# Altium schematic sheet Amplifiers2.SchDoc
size A4; SheetNumber: 6; SheetTotal: 7
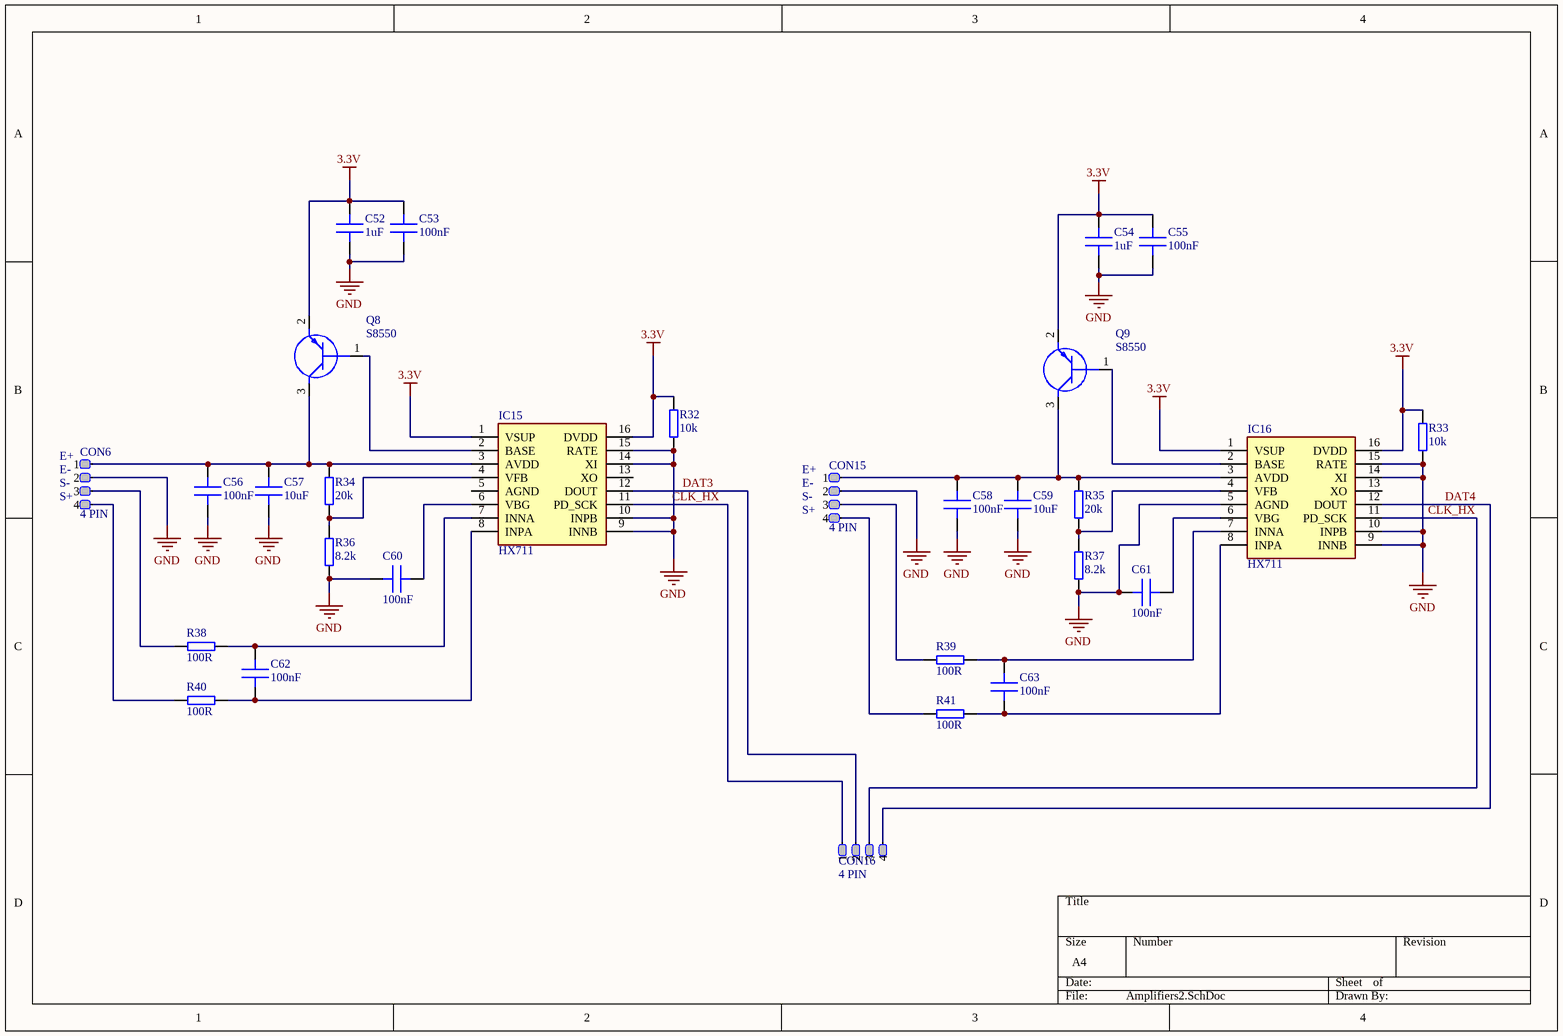
[diagram p0: Amplifiers2.SchDoc]

## Parts
C52  1uF  [C 0402]
C53  100nF  [C 0402]
C54  1uF  [C 0402]
C55  100nF  [C 0402]
C56  100nF  [C 0402]
C57  10uF  [C 0402]
C58  100nF  [C 0402]
C59  10uF  [C 0402]
C60  100nF  [C 0402]
C61  100nF  [C 0402]
C62  100nF  [C 0402]
C63  100nF  [C 0402]
CON6  4 PIN  [BM04B-SRSS-TB]
CON15  4 PIN  [BM04B-SRSS-TB]
CON16  4 PIN  [Goldpin 1.27mm 4PIN]
IC15  HX711  [SOIC127P600X160-16N]
IC16  HX711  [SOIC127P600X160-16N]
Q8  S8550  [SOT95P240X110-3N]
Q9  S8550  [SOT95P240X110-3N]
R32  10k  [R 0402]
R33  10k  [R 0402]
R34  20k  [R 0402]
R35  20k  [R 0402]
R36  8.2k  [R 0402]
R37  8.2k  [R 0402]
R38  100R  [R 0402]
R39  100R  [R 0402]
R40  100R  [R 0402]
R41  100R  [R 0402]

## Nets
3.3V: C52.1 C53.1 C54.1 C55.1 IC15.1(VSUP) IC15.16(DVDD) IC16.1(VSUP) IC16.16(DVDD) Q8.2(E) Q9.2(E) R32.2 R33.2
GND: C52.2 C53.2 C54.2 C55.2 C56.2 C57.2 C58.2 C59.2 C60.1 C61.1 CON6.2 CON15.2 IC15.9(INNB) IC15.10(INPB) IC15.14(XI) IC15.15(RATE) IC16.5(AGND) IC16.9(INNB) IC16.10(INPB) IC16.14(XI) IC16.15(RATE) R32.1 R33.1 R36.1 R37.1
CLK_HX: CON16.1 CON16.3 IC15.11(PD_SCK) IC16.11(PD_SCK)
DAT3: CON16.2 IC15.12(DOUT)
DAT4: CON16.4 IC16.12(DOUT)
NetC56_1: C56.1 C57.1 CON6.1 IC15.3(AVDD) Q8.3(C) R34.2
NetC58_1: C58.1 C59.1 CON15.1 IC16.3(AVDD) Q9.3(C) R35.2
NetC60_2: C60.2 IC15.6(VBG)
NetC61_2: C61.2 IC16.6(VBG)
NetC62_1: C62.1 IC15.8(INPA) R40.1
NetC62_2: C62.2 IC15.7(INNA) R38.1
NetC63_1: C63.1 IC16.8(INPA) R41.1
NetC63_2: C63.2 IC16.7(INNA) R39.1
NetCON6_3: CON6.3 R38.2
NetCON6_4: CON6.4 R40.2
NetCON15_3: CON15.3 R39.2
NetCON15_4: CON15.4 R41.2
NetIC15_2: IC15.2(BASE) Q8.1(B)
NetIC15_4: IC15.4(VFB) R34.1 R36.2
NetIC16_2: IC16.2(BASE) Q9.1(B)
NetIC16_4: IC16.4(VFB) R35.1 R37.2

Not connected (* = marked no-connect by the designer): IC15 5(AGND) 13(XO); IC16 13(XO)

## Notes on the sheet
- (near CON6) E+
- (near CON6) E-
- (near CON6) S-
- (near CON6) S+
- (near CON15) E+
- (near CON15) E-
- (near CON15) S-
- (near CON15) S+

## Library data of the parts
C52-C63 = Capacitor: MLCC Capacitor
IC15 IC16 = HX711: Integrated Circuit; Manufacturer_Name: AVIA; Datasheet Link: https://cdn.sparkfun.com/datasheets/Sensors/ForceFlex/hx711_english.pdf; Height: 1.6mm; Manufacturer_Part_Number: HX711
Q8 Q9 = S8550: Transistor BJT PNP; Manufacturer_Name: Galaxy; Datasheet Link: https://datasheet.datasheetarchive.com/originals/distributors/Datasheets-3/DSA-49109.pdf; Height: 1.1mm; Manufacturer_Part_Number: S8550
R32-R41 = Resistor: General pourpouse resistor